# EAGLE design PS4-sequencer (EAGLE 9.7.0)
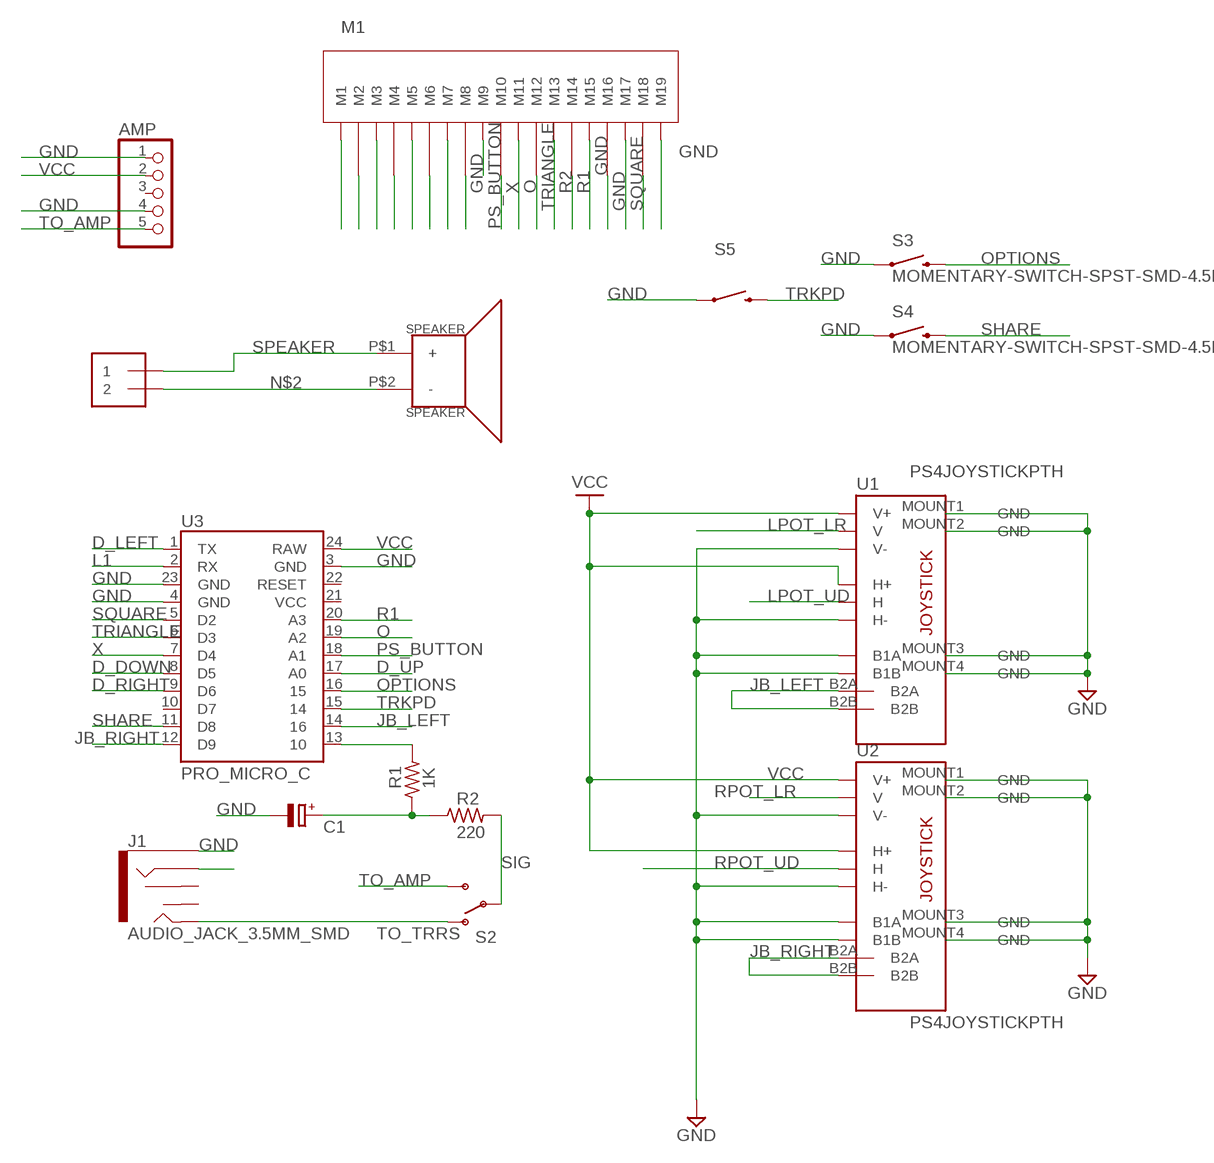
[diagram p0: schematic, sheet 1]

## Parts
AMP  PINHD-1X5  [1X05]
C1  CAPACITOR-POLRADIAL-5MM-DIA  [CAPPRD254W65D500H1150B]
J1  AUDIO_JACK_3.5MM_SMD  [AUDIO-JACK-3.5MM-SMD]
J2  1X2-3.5MM  [1X2-3.5MM]
M1  PS4MEMBRANE  [PS4MEMBRANE]
R1  1K  R-US_AXIAL-7.2MM-PITCH  [RESAD724W46L381D178B]
R2  220  R-US_AXIAL-7.2MM-PITCH  [RESAD724W46L381D178B]
S2  SWITCH-SPDTSMD  [SWITCH_SPDT_SMD]
S3  MOMENTARY-SWITCH-SPST-SMD-4.5MM  [TACTILE_SWITCH_SMD_3.6MM]
S4  MOMENTARY-SWITCH-SPST-SMD-4.5MM  [TACTILE_SWITCH_SMD_3.6MM]
S5  TAC_SWITCHSMD  MOMENTARY-SWITCH-SPST-SMD-5.2MM  [TACTILE_SWITCH_SMD_6MM]
SPEAKER  SPEAKER  [PS4_SPEAKER]
U1  PS4JOYSTICKPTH  [PS4JOYSTICK]
U2  PS4JOYSTICKPTH  [PS4JOYSTICK]
U3  PRO_MICRO_C  [PRO_MICRO_C]

## Nets
D_DOWN: M1.8(M8) U3.8(D5)
D_LEFT: M1.7(M7) U3.1(TX)
D_RIGHT: M1.5(M5) U3.9(D6)
D_UP: M1.6(M6) U3.17(A0)
GND: AMP.1 AMP.4 C1.2(-) J1.SLEEVE M1.3(M3) M1.9(M9) M1.16(M16) M1.17(M17) M1.19(M19) S3.2 S3.3 S4.2 S4.3 S5.1 U1.B1A U1.B1B U1.H3(H-) U1.MOUNT1(GND) U1.MOUNT2(GND) U1.MOUNT3(GND) U1.MOUNT4(GND) U1.V3(V-) U2.B1A U2.B1B U2.H3(H-) U2.MOUNT1(GND) U2.MOUNT2(GND) U2.MOUNT3(GND) U2.MOUNT4(GND) U2.V3(V-) U3.3(GND) U3.4(GND) U3.23(GND)
JB_LEFT: U1.B2A U1.B2B U3.14
JB_RIGHT: U2.B2A U2.B2B U3.12(D9)
L1: M1.2(M2) U3.2(RX)
L2: M1.1(M1)
LPOT_LR: U1.V2(V)
LPOT_UD: U1.H2(H)
N$1: C1.1(+) R1.1 R2.1
N$2: J2.2 SPEAKER.P$2(-)
N$4: J1.RING1(RING)
N$8: R1.2 U3.13
N$24: M1.4(M4)
O: M1.12(M12) U3.19(A2)
OPTIONS: S3.1 S3.4 U3.16
PS_BUTTON: M1.10(M10) U3.18(A1)
R1: M1.15(M15) U3.20(A3)
R2: M1.14(M14)
RPOT_LR: U2.V2(V)
RPOT_UD: U2.H2(H)
SHARE: S4.1 S4.4 U3.11(D8)
SIG: R2.2 S2.2(P)
SPEAKER: J2.1 SPEAKER.P$1(+)
SQUARE: M1.18(M18) U3.5(D2)
TO_AMP: AMP.5 S2.3(S)
TO_TRRS: J1.TIP S2.1(O)
TRIANGLE: M1.13(M13) U3.6(D3)
TRKPD: S5.3 U3.15
VCC: AMP.2 U1.H1(H+) U1.V1(V+) U2.H1(H+) U2.V1(V+) U3.24(RAW)
X: M1.11(M11) U3.7(D4)
Unconnected: AMP.3 J1.RSH J1.TSH U3.10(D7) U3.21(VCC) U3.22(RESET)

## Library data of the parts
AMP = pinhead:PINHD-1X5: PIN HEADER
C1 = Tinkercad:CAPACITOR-POL: Capacitor Polarised - Generic
J1 = controller:AUDIO_JACK_3.5MM: Audio Jack 3.5mm variants of PTH and SMT stereo audio jack with bypass switches. SparkFun Products: SparkFun SparkPunk Sound Kit <[https://www.sparkfun.com/products/11177]> - PTH MP3 Trigger <https://www.sparkfun.com/products/13720> -3.5mm SMD SparkFun PicoBoard <https://www.sparkfun.com/products/11888>- 2.5mm SMD; PROD_ID: CONN-10353
J2 = adafruit:1X2: 3.5mm Terminal block http://www.ladyada.net/library/pcb/eaglelibrary.html
M1 = controller:PS4MEMBRANE
R1 R2 = Tutorial - Fusion 360:R-US: Resistor Fixed - ANSI; CATEGORY: Resistor; SUB-CATEGORY: Fixed
S2 = controller:SWITCH-SPDT: SPDT Switch Simple slide switch, Spark Fun Electronics SKU : COM-00102 DPDT SMT slide switch, AYZ0202, SWCH-08179
S3 S4 = controller:MOMENTARY-SWITCH-SPST: Momentary Switch (Pushbutton) - SPST Normally-open (NO) SPST momentary switches (buttons, pushbuttons). Variants PTH-12MM - 12mm square, through-hole Momentary Pushbutton Switch - 12mm Square <https://www.sparkfun.com/products/9190> (COM-09190) PTH-6.0MM, PTH-6.0MM-KIT - 6.0mm square, through-hole Mini Pushbutton Switch <https://www.sparkfun.com/products/97> (COM-00097) KIT package intended for soldering kit's - only one side of pads' copper is exposed. PTH-RIGHT-ANGLE-KIT - Right-angle, through-hole Right Angle Tactile Button <https://www.sparkfun.com/products/10791> - Used on SparkFun BigTime Watch Kit <https://www.sparkfun.com/products/11734> SMD-12MM - 12mm square, surface-mount Tactile Button - SMD (12mm) <https://www.sparkfun.com/products/12993> (COM-12993) Used on SparkFun PicoBoard <https://www.sparkfun.com/products/11888> SMD-4.5MM - 4.5mm Square Trackball Switch Used on SparkFun Blackberry Trackballer Breakout <https://www.sparkfun.com/products/13169> SMD-4.6MMX2.8MM - 4.60mm x 2.80mm, surface mount Used on SparkFun SAMD21 Mini Breakout <https://www.sparkfun.com/products/13664> SMD-5.2MM, SMD-5.2-REDUNDANT - 5.2mm square, surface-mount Mini Pushbutton Switch - SMD <https://www.sparkfun.com/products/8720> (COM-08720) Used on Arduino Pro Mini <https://www.sparkfun.com/products/11114> REDUNDANT package connects both switch circuits together SMD-6.0X3.5MM - 6.0 x 3.5mm, surface mount Momentary Reset Switch SMD <https://www.sparkfun.com/products/8229> (COM-08229) SMD-6.2MM-TALL - 6.2mm square, surface mount Tactile Button - SMD (6mm) <https://www.sparkfun.com/products/12992> Used on SparkFun Digital Sandbox <https://www.sparkfun.com/products/12651> SMD-RIGHT-ANGLE - Right-angle, surface mount Used on SparkFun Block for Intel® Edison - Arduino <https://www.sparkfun.com/products/13036>; PROD_ID: SWCH-09213
S5 = controller:MOMENTARY-SWITCH-SPST: Momentary Switch (Pushbutton) - SPST Normally-open (NO) SPST momentary switches (buttons, pushbuttons). Variants PTH-12MM - 12mm square, through-hole Momentary Pushbutton Switch - 12mm Square <https://www.sparkfun.com/products/9190> (COM-09190) PTH-6.0MM, PTH-6.0MM-KIT - 6.0mm square, through-hole Mini Pushbutton Switch <https://www.sparkfun.com/products/97> (COM-00097) KIT package intended for soldering kit's - only one side of pads' copper is exposed. PTH-RIGHT-ANGLE-KIT - Right-angle, through-hole Right Angle Tactile Button <https://www.sparkfun.com/products/10791> - Used on SparkFun BigTime Watch Kit <https://www.sparkfun.com/products/11734> SMD-12MM - 12mm square, surface-mount Tactile Button - SMD (12mm) <https://www.sparkfun.com/products/12993> (COM-12993) Used on SparkFun PicoBoard <https://www.sparkfun.com/products/11888> SMD-4.5MM - 4.5mm Square Trackball Switch Used on SparkFun Blackberry Trackballer Breakout <https://www.sparkfun.com/products/13169> SMD-4.6MMX2.8MM - 4.60mm x 2.80mm, surface mount Used on SparkFun SAMD21 Mini Breakout <https://www.sparkfun.com/products/13664> SMD-5.2MM, SMD-5.2-REDUNDANT - 5.2mm square, surface-mount Mini Pushbutton Switch - SMD <https://www.sparkfun.com/products/8720> (COM-08720) Used on Arduino Pro Mini <https://www.sparkfun.com/products/11114> REDUNDANT package connects both switch circuits together SMD-6.0X3.5MM - 6.0 x 3.5mm, surface mount Momentary Reset Switch SMD <https://www.sparkfun.com/products/8229> (COM-08229) SMD-6.2MM-TALL - 6.2mm square, surface mount Tactile Button - SMD (6mm) <https://www.sparkfun.com/products/12992> Used on SparkFun Digital Sandbox <https://www.sparkfun.com/products/12651> SMD-RIGHT-ANGLE - Right-angle, surface mount Used on SparkFun Block for Intel® Edison - Arduino <https://www.sparkfun.com/products/13036>; PROD_ID: SWCH-08247; SF_SKU: COM-08720
SPEAKER = controller:SPEAKER: Speaker Generic 2-terminal loudspeakers SparkFun Products Speaker - PCB Mount <https://www.sparkfun.com/products/11089> (COM-11089)
U1 U2 = ps4joystick:PS4JOYSTICK: Thumb Joystick Joystick commonly found in PS2 controllers. Two pots and a select switch. Adapted from Sparkfun Library (but for more common 6mm switch sticks)
U3 = SparkFun-Boards:PRO_MICRO_C

## Board
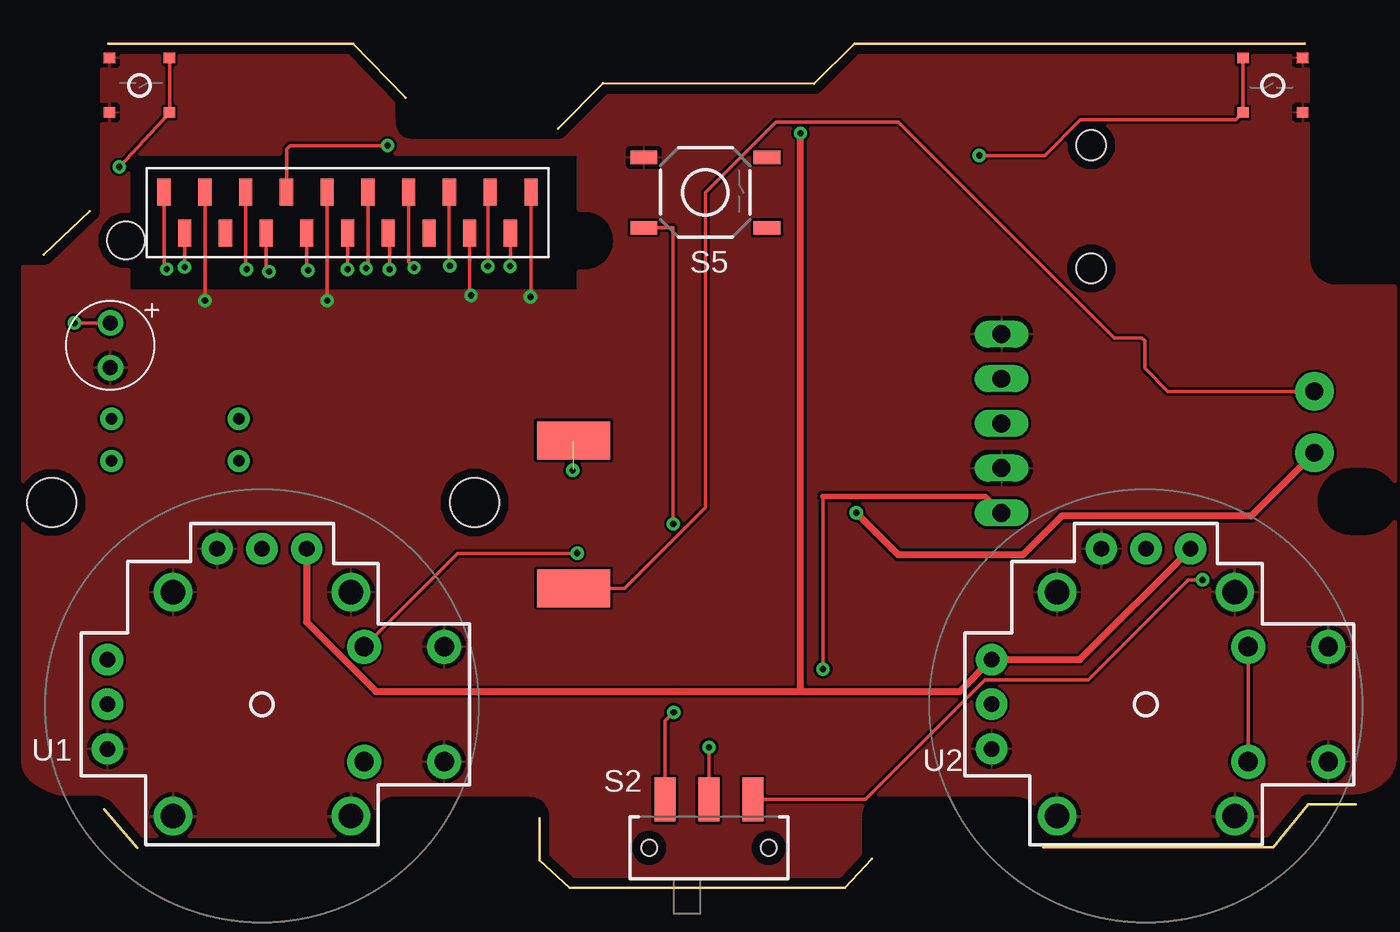
[diagram p1: board, top side]
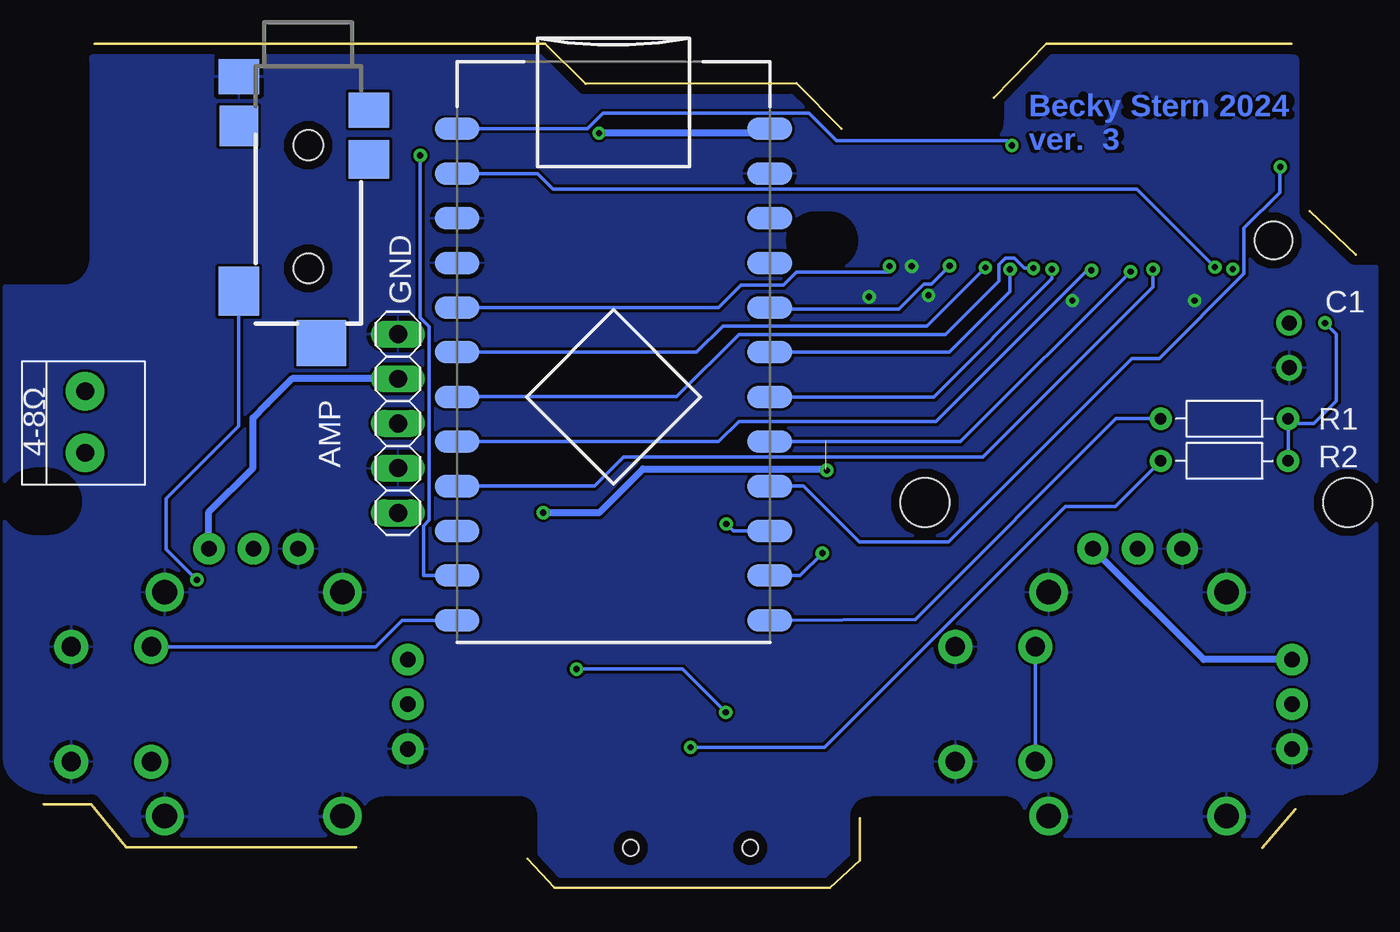
[diagram p2: board, bottom side, seen from below]

Size 74.56 x 47.99 mm. Coordinates in mm from the lower left corner, seen from the top.
Outline: 2.61,38.49 0,36.01
Outline: 3.43,4.48 5.29,2.27
Outline: 28.17,3.97 28.17,1.56 29.87,0 45.55,0 47.07,1.66
Outline: 56.83,2.31 69.88,2.31 71.88,4.75 74.56,4.75
Outline: 71.68,47.99 46.07,47.99 43.78,45.72 31.79,45.76 29.22,43.17
Outline: 20.56,44.93 17.57,47.99 3.66,47.99
Copper layers (1*16): Top / Bottom
Stack-up Default Layer Stack: Top User Defined 0.035mm / Dielectric-1 User Defined 1.5mm / Bottom User Defined 0.035mm
Design rules: minimum drill size 0.35mm, minimum copper width 8mil, keepout clearance 0mil, drill distance 10mil, via restrict clearance 0mil, solder-mask clearance 0mil, dimension clearance 20mil, restrict clearance 0mil, copper clearance wire_polygon to wire_polygon 6mil, copper clearance wire_polygon to pad_smd 6mil, copper clearance wire_polygon to via 6mil, copper clearance pad_smd to pad_smd 6mil, copper clearance pad_smd to via 6mil, copper clearance via to via 6mil, copper clearance smd to pad (same net) 6mil, copper clearance smd to via (same net) 6mil, copper clearance smd to smd (same net) 6mil
Holes 2.8 mm at 24.48,21.91 0.45,21.91
Holes 2.14 mm at 4.66,36.81

### Footprints (pad centres in the part's own frame; a part is rotated, then mirrored left to right if it is on the bottom)
1X05 = drill 1.016 long: 1 -5.08,0; 2 -2.54,0; 3 0,0; 4 2.54,0; 5 5.08,0
CAPPRD254W65D500H1150B = drill 0.85 pad 1.45: 1 -1.27,0; 2 1.27,0
AUDIO-JACK-3.5MM-SMD = smd 2.2 x 2.3: RING1 5.3,3.45 | smd 2.3 x 2.2: RING2 3.4,-3.95 | smd 2 x 2.3: RSH 2.5,3.45; SLEEVE 0.6,-3.95 | smd 2.8 x 2.3: TIP 12.8,-3.95 | smd 2.6 x 2.8: TSH 15.75,0.75 | hole 1.7: 4.5,0; 11.5,0
1X2-3.5MM = drill 1 pad 2.184: 1 1.8,0; 2 -1.7,0
PS4MEMBRANE = smd 0.752 x 1.529: 1 -10.431,1.161; 2 -9.262,-1.161; 3 -8.105,1.161; 4 -6.947,-1.161; 5 -5.789,1.161; 6 -4.631,-1.161; 7 -3.473,1.161; 8 -2.316,-1.161; 9 -1.158,1.161; 10 0,-1.161; 11 1.158,1.161; 12 2.316,-1.161; 13 3.473,1.161; 14 4.631,-1.161; 15 5.789,1.161; 16 6.947,-1.161; 17 8.105,1.161; 18 9.262,-1.161; 19 10.431,1.161
RESAD724W46L381D178B = drill 0.66 pad 1.26: 1 -3.62,0; 2 3.62,0
SWITCH_SPDT_SMD = smd 1.2 x 2.5: 1 -2.5,-2.75; 2 0,-2.75; 3 2.5,-2.75 | hole 0.9: -3.4,0; 3.4,0
TACTILE_SWITCH_SMD_3.6MM = smd 0.6 x 0.65: 1 1.55,1.7; 2 1.55,-1.7; 3 -1.55,-1.7; 4 -1.55,1.7
TACTILE_SWITCH_SMD_6MM = smd 1.524 x 0.762: 1 -3.5,2; 2 3.5,2; 3 -3.5,-2; 4 3.5,-2
PS4_SPEAKER = smd 4.166 x 2.159: P$1 -0.076,4.242; P$2 -0.076,-4.166
PS4JOYSTICK = drill 1.1 pad 1.93: B1A -3.269,10.362; B1B 3.269,10.362; B2A -3.269,5.81; B2B 3.269,5.81 | drill 0.889 pad 1.778: H1 -2.54,-8.781; H2 0,-8.781; H3 2.54,-8.781; V1 -8.838,2.54; V2 -8.838,0; V3 -8.838,-2.54 | drill 1.397 pad 2.184: MOUNT1 -6.367,5.049; MOUNT2 -6.367,-5.049; MOUNT3 6.367,-5.049; MOUNT4 6.367,5.049
PRO_MICRO_C = smd 2.54 x 1.27: 1 -8.89,12.7; 2 -8.89,10.16; 3 -8.89,7.62; 4 -8.89,5.08; 5 -8.89,2.54; 6 -8.89,0; 7 -8.89,-2.54; 8 -8.89,-5.08; 9 -8.89,-7.62; 10 -8.89,-10.16; 11 -8.89,-12.7; 12 -8.89,-15.24; 13 8.89,-15.24; 14 8.89,-12.7; 15 8.89,-10.16; 16 8.89,-7.62; 17 8.89,-5.08; 18 8.89,-2.54; 19 8.89,0; 20 8.89,2.54; 21 8.89,5.08; 22 8.89,7.62; 23 8.89,10.16; 24 8.89,12.7

### Placement (x,y rotation side)
AMP  54.44,26.41 270 bottom
C1  3.77,30.86 270 top
J1  59.54,46.73 270 bottom
J2  72.22,26.54 270 bottom
M1  17.26,38.4 0 top
R1  7.45,26.68 180 bottom
R2  7.45,24.28 180 bottom
S2  37.8,2.28 180 top
S3  5.43,45.64 270 top
S4  69.86,45.64 90 top
S5  37.6,39.54 0 top
SPEAKER  30.18,21.2 0 top
U1  12.39,10.44 270 top
U2  62.65,10.44 270 top
U3  42.19,30.46 0 bottom

### Tracks (layer width: path | path; a pad name or v marks a point on that pad's centre or on a via)
D_DOWN  (via drill 0.35)
  Top 0.203: v15.01,35.11 14.94,35.18 M1.8
  Bottom 0.203: U3.8 36.2,25.38 35.06,26.52 23.86,26.52 15.27,35.11 v15.01,35.11
D_LEFT  (via drill 0.35)
  Top 0.203: M1.7 13.78,42.01 13.99,42.22 v19.54,42.22
  Bottom 0.203: U3.1 43.67,43.16 42.78,44.05 31.07,44.05 29.51,42.48 19.8,42.48 v19.54,42.22
D_RIGHT  (via drill 0.35)
  Top 0.203: M1.5 11.47,35.22 v11.52,35.17
  Bottom 0.203: v11.52,35.17 11.52,34.16 21.18,24.49 41.62,24.49 43.27,22.84 U3.9
D_UP  (via drill 0.35)
  Top 0.203: M1.6 12.62,35.21 v12.79,35.05
  Bottom 0.203: U3.17 22.45,25.38 v12.79,35.05
GND  (via drill 0.35)
  Top 0.203: M1.3 v9.15,33.4 | M1.9 v16.1,33.39 | M1.17 25.23,39.43 v25.23,35.35 | M1.16 24.2,33.78 v24.28,33.7 | v27.65,33.61 27.69,33.64 M1.19
  pour Top: 0.75,4.68 0.75,4.68 -1.87,5.29 -1.87,8.96 -1.87,35.57 -1.87,35.57 -1.87,35.57 -1.87,35.57 -1.87,36.01 -1.05,36.01 0,36.01 0,36.01 0,36.01 2.61,38.49 2.61,38.49 2.61,46.78 2.61,47.04 2.61,47.52 2.93,47.99 3.66,47.99 3.66,47.99 17.57,47.99 20.56,44.93 20.56,44.93 20.56,44.05 20.56,43.31 20.67,43.17 21.21,43.17 29.22,43.17 29.22,43.17 29.22,43.17 31.79,45.76 43.78,45.72 46.07,47.99 71.68,47.99 72.7,47.99 72.6,47.04 72.53,46.97 72.56,35.7 72.56,35.7 72.56,35.7 72.56,35.7 72.7,34.89 74.19,34.89 77.08,34.89 77.08,34.89 77.08,34.89 77.08,34.89 77.48,34.99 77.48,34.04 77.48,9.08 77.48,5.72 75.78,4.76 74.56,4.75 74.56,4.75 71.88,4.75 69.88,2.31 56.83,2.31 56.83,2.31 55.88,2.24 55.88,3.8 55.85,4.14 55.85,4.14 55.85,4.14 55.85,4.14 55.88,4.62 54.59,4.62 47.38,4.62 47.38,4.62 47.38,4.62 47.38,4.62 47.07,4.55 47.07,3.39 47.07,1.66 47.07,1.66 47.07,1.66 45.55,0 29.87,0 28.17,1.56 28.17,3.97 28.17,3.97 28.2,4.62 26.91,4.62 19.79,4.62 19.79,4.62 19.79,4.62 19.79,4.62 19.41,4.58 19.41,3.36 19.41,3.31 19.41,2.52 19.18,2.27 18.23,2.27 5.29,2.27 5.29,2.27 5.29,2.27 3.43,4.48 3.43,4.48 3.19,4.68 2.51,4.68 0.75,4.68 0.75,4.68
  pour Bottom: 0.75,4.68 0.75,4.68 -1.87,5.29 -1.87,8.96 -1.87,35.57 -1.87,35.57 -1.87,35.57 -1.87,35.57 -1.87,36.01 -1.05,36.01 0,36.01 0,36.01 0,36.01 2.61,38.49 2.61,38.49 2.61,46.78 2.61,47.04 2.61,47.52 2.93,47.99 3.66,47.99 3.66,47.99 17.57,47.99 20.56,44.93 20.56,44.93 20.56,44.05 20.56,43.31 20.67,43.17 21.21,43.17 29.22,43.17 29.22,43.17 29.22,43.17 31.77,45.74 43.76,45.7 46.07,47.99 71.68,47.99 72.7,47.99 72.6,47.04 72.53,46.97 72.56,35.7 72.56,35.7 72.56,35.7 72.56,35.7 72.7,34.89 74.19,34.89 77.08,34.89 77.08,34.89 77.08,34.89 77.08,34.89 77.48,34.99 77.48,34.04 77.48,9.08 77.48,5.72 75.78,4.76 74.56,4.75 74.56,4.75 71.88,4.75 69.88,2.31 56.83,2.31 56.83,2.31 55.88,2.24 55.88,3.8 55.85,4.14 55.85,4.14 55.85,4.14 55.85,4.14 55.88,4.62 54.59,4.62 47.38,4.62 47.38,4.62 47.38,4.62 47.38,4.62 47.07,4.55 47.07,3.39 47.07,1.66 47.07,1.66 47.07,1.66 45.55,0 29.87,0 28.17,1.56 28.17,3.97 28.17,3.97 28.2,4.62 26.91,4.62 19.79,4.62 19.79,4.62 19.79,4.62 19.79,4.62 19.41,4.58 19.41,3.36 19.41,3.31 19.41,2.52 19.18,2.27 18.23,2.27 5.29,2.27 5.29,2.27 5.29,2.27 3.43,4.48 3.43,4.48 3.19,4.68 2.51,4.68 0.75,4.68 0.75,4.68
JB_LEFT  (via drill 0.35)
  Top 0.203: v30.31,19.03 23.52,19.03 U1.B2A
  Bottom 0.203: U1.B2B U1.B2A | U3.14 31.58,17.76 v30.31,19.03
JB_RIGHT
  Top 0.203: U2.B2A U2.B2B
  Bottom 0.203: U2.B2A 55.71,13.71 54.2,15.22 U3.12
L1  (via drill 0.35)
  Top 0.203: M1.2 v7.99,35.3
  Bottom 0.203: U3.2 46.52,40.62 45.63,39.73 12.42,39.73 v7.99,35.3
L2  (via drill 0.35)
  Top 0.203: M1.1 6.83,35.34 v6.98,35.19
N$1  (via drill 0.35)
  Top 0.203: C1.1 v1.74,32.13
  Bottom 0.203: R2.1 3.83,26.41 | 3.83,26.41 R1.1 | v1.74,32.13 1.1,31.49 1.1,27.68 2.37,26.41 3.83,26.41
N$2
  Top 0.203: SPEAKER.P$2 33.01,17.04 37.6,21.63 37.6,39.55 41.61,43.55 48.58,43.55 60.86,31.28 62.43,31.28 62.58,31.13 62.58,29.56 63.9,28.24 J2.2
N$8
  Bottom 0.203: U3.13 25.02,15.27 13.61,26.68 R1.2
O  (via drill 0.35)
  Top 0.203: M1.12 19.64,37.17 v19.64,35.17
  Bottom 0.203: v19.64,35.17 19.64,33.9 23.09,30.46 U3.19
OPTIONS  (via drill 0.35)
  Top 0.203: S3.4 S3.1 v4.28,41
  Bottom 0.203: v4.28,41 4.3,40.97 4.3,39.55 6.34,37.51 6.34,34.93 11.17,30.1 12.71,30.1 23.15,19.67 28.22,19.67 31.39,22.84 U3.16
PS_BUTTON  (via drill 0.35)
  Top 0.203: M1.10 v17.26,35.17
  Bottom 0.203: v17.26,35.17 17.26,34.64 23.97,27.92 U3.18
R1  (via drill 0.35)
  Top 0.203: M1.15 23.04,35.4 v23.07,35.37
  Bottom 0.203: U3.20 33.22,32.93 25.95,32.93 24.54,34.33 24.12,34.33 v23.07,35.37
SHARE  (via drill 0.35)
  Top 0.203: S4.1 S4.4 67.76,43.69 58.93,43.69 56.89,41.65 v53.17,41.65
  Bottom 0.203: U3.11 52.98,17.76 52.98,20.59 52.66,20.91 52.66,31.91 53.17,32.42 v53.17,41.65
SIG  (via drill 0.35)
  Top 0.203: v37.8,8 S2.2
  Bottom 0.203: R2.2 13.66,21.7 16.49,21.7 30.19,8 v37.8,8
SPEAKER  (via drill 0.35)  (1 unrouted)
  Top 0.203: v30.06,23.74 30.11,23.8
  Top 0.406: J2.1 68.63,21.15 57.87,21.15 55.67,18.94 48.57,18.94 v46.18,21.33
  Bottom 0.406: v46.18,21.33 43.01,21.33 40.51,23.83 30.15,23.83 v30.06,23.74
SQUARE  (via drill 0.35)
  Top 0.203: M1.18 26.52,35.37 v26.5,35.35
  Bottom 0.203: U3.5 36.2,33 34.93,34.27 32.53,34.27 31.79,35.01 26.5,35.01 v26.5,35.35
TO_AMP  (via drill 0.35)
  Top 0.203: v44.28,12.44 44.28,22.26 | v35.8,9.99 35.3,9.49 S2.3
  Top 0.305: 44.28,22.26 53.51,22.26 AMP.5
  Bottom 0.203: v44.28,12.44 38.26,12.44 v35.8,9.99
TO_TRRS  (via drill 0.35)
  Top 0.203: v65.87,17.52 65.05,17.52 59.37,11.84 53.5,11.84 46.69,5.03 S2.1
  Bottom 0.203: v65.87,17.52 67.61,19.26 67.61,22.15 63.49,26.27 J1.TIP
TRIANGLE  (via drill 0.35)
  Top 0.203: M1.13 20.73,35.58 v21.04,35.27
  Bottom 0.203: U3.6 37.47,30.46 35.97,31.96 24.35,31.96 v21.04,35.27
TRKPD  (via drill 0.35)
  Top 0.203: v35.77,20.7 35.77,37.54 35.76,37.54 S5.3
  Bottom 0.203: U3.15 35.38,20.3 v35.77,20.7
VCC  (via drill 0.35)
  Top 0.406: U2.V1 58.89,12.98 U2.H1 52.06,11.17 43.01,11.17 | 43.01,11.17 v43.01,42.92 | U1.V1 14.93,15.12 18.87,11.17 43.01,11.17
  Bottom 0.203: U3.24 33.54,42.92
  Bottom 0.406: U1.H1 8.63,12.98 U1.V1 | 33.54,42.92 v43.01,42.92 | U2.V1 65.19,21.37 62.68,23.89 62.68,26.73 61.89,27.51 60.45,28.95 AMP.2
X  (via drill 0.35)
  Top 0.203: M1.11 18.41,35.34 v18.31,35.24
  Bottom 0.203: U3.7 51.06,27.94 38.6,27.94 35.06,31.48 23.31,31.48 20.28,34.51 20.28,35.44 19.91,35.81 19.38,35.81 18.81,35.24 v18.31,35.24
(copper drawn outside any net)
  shapes: Top area x1

### Text on the board
Bottom: Becky Stern 2024 / ver. 3
bPlace: GND | 4-8Ω